# Altium schematic sheet StEth32_W5500.SchDoc
size A4
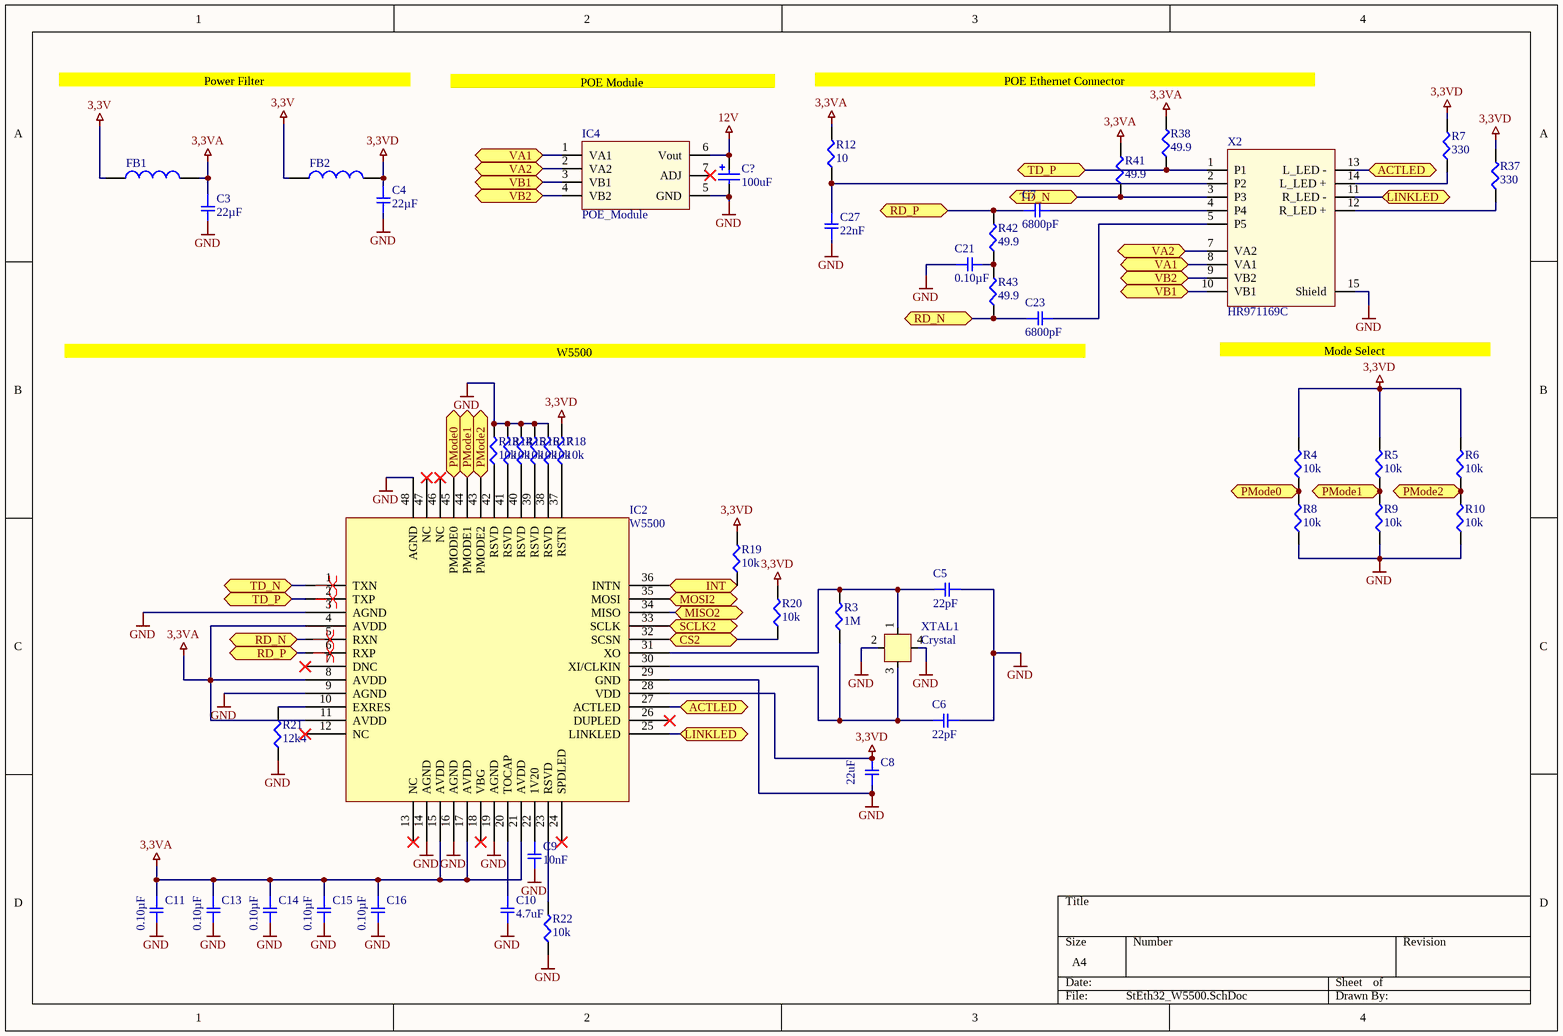
[diagram p0: StEth32_W5500.SchDoc]

## Parts
C3  22µF  [SMD-0603C]
C4  22µF  [SMD-0603C]
C5  22pF  [SMD-0603C]
C6  22pF  [SMD-0603C]
C7  6800pF  [SMD-0603C]
C8  22uF  [SMD-0603C]
C9  10nF  [SMD-0603C]
C10  4.7uF  [SMD-0603C]
C11  0.10µF  [SMD-0603C]
C13  0.10µF  [SMD-0603C]
C14  0.10µF  [SMD-0603C]
C15  0.10µF  [SMD-0603C]
C16  0.10µF  [SMD-0603C]
C21  0.10µF  [SMD-0603C]
C23  6800pF  [SMD-0603C]
C27  22nF  [SMD-0603C]
C?  value 100uF  [WCAP-ASLI_6.3x7.7]  (hidden comment: 865080445010)
FB1  600Ohm, 0.2A  [WE-CBF_0805_High Speed]  (value not drawn)
FB2  600Ohm, 0.2A  [WE-CBF_0805_High Speed]  (value not drawn)
IC2  W5500  [LQFP-48]
IC4  POE_Module  [POE_Module]
R3  1M  [SMD-0402-RES]
R4  10k  [SMD-0603-RES]
R5  10k  [SMD-0603-RES]
R6  10k  [SMD-0603-RES]
R7  330  [SMD-0603-RES]
R8  10k  [SMD-0603-RES]
R9  10k  [SMD-0603-RES]
R10  10k  [SMD-0603-RES]
R12  10  [SMD-0603-RES]
R13  10k  [SMD-0603-RES]
R14  10k  [SMD-0603-RES]
R15  10k  [SMD-0603-RES]
R16  10k  [SMD-0603-RES]
R17  10k  [SMD-0603-RES]
R18  10k  [SMD-0603-RES]
R19  10k  [SMD-0603-RES]
R20  10k  [SMD-0603-RES]
R21  12k4  [SMD-0603-RES]
R22  10k  [SMD-0603-RES]
R37  330  [SMD-0603-RES]
R38  49.9  [SMD-0603-RES]
R41  49.9  [SMD-0603-RES]
R42  49.9  [SMD-0603-RES]
R43  49.9  [SMD-0603-RES]
X2  HR971169C  [HR971169C]
XTAL1  Crystal  [3225]

## Ports
ACTLED (bidir), CS2 (bidir), INT (bidir), LINKLED (bidir), MISO2 (bidir), MOSI2 (bidir), PMode0 (bidir), PMode1 (bidir), PMode2 (bidir), RD_N (bidir), RD_P (bidir), SCLK2 (bidir), TD_N (bidir), TD_P (bidir), VA1 (bidir), VA2 (bidir), VB1 (bidir), VB2 (bidir)

## Nets
3,3V: FB1.1 FB2.1
3,3VA: C3.1 C11.1 C13.1 C14.1 C15.1 C16.1 FB1.2 IC2.4(AVDD) IC2.8(AVDD) IC2.11(AVDD) IC2.15(AVDD) IC2.17(AVDD) IC2.21(AVDD) R12.2 R38.2 R41.2
3,3VD: C4.1 C8.1 FB2.2 IC2.28(VDD) R4.2 R5.2 R6.2 R7.2 R18.2 R19.2 R20.2 R37.2
12V: C?.1(P) IC4.6(Vout)
GND: C3.2 C4.2 C5.1 C6.1 C8.2 C9.2 C10.2 C11.2 C13.2 C14.2 C15.2 C16.2 C21.1 C27.1 C?.2(N) IC2.3(AGND) IC2.9(AGND) IC2.14(AGND) IC2.16(AGND) IC2.19(AGND) IC2.29(GND) IC2.48(AGND) IC4.5(GND) R8.1 R9.1 R10.1 R13.2 R14.2 R15.2 R16.2 R17.2 R21.1 R22.1 X2.15(Shield) XTAL1.2 XTAL1.4
ACTLED: IC2.27(ACTLED) X2.13(L_LED_-) ; port ACTLED
CS2: IC2.32(SCSN) R20.1 ; port CS2
INT: IC2.36(INTN) R19.1 ; port INT
LINKLED: IC2.25(LINKLED) X2.11(R_LED_-) ; port LINKLED
MISO2: IC2.34(MISO) ; port MISO2
MOSI2: IC2.35(MOSI) ; port MOSI2
PMode0: IC2.45(PMODE0) R4.1 R8.2 ; port PMode0
PMode1: IC2.44(PMODE1) R5.1 R9.2 ; port PMode1
PMode2: IC2.43(PMODE2) R6.1 R10.2 ; port PMode2
RD_N: C23.1 IC2.5(RXN) R43.1 ; port RD_N
RD_P: C7.1 IC2.6(RXP) R42.2 ; port RD_P
SCLK2: IC2.33(SCLK) ; port SCLK2
TD_N: IC2.1(TXN) R41.1 X2.3(P3) ; port TD_N
TD_P: IC2.2(TXP) R38.1 X2.1(P1) ; port TD_P
VA1: IC4.1(VA1) X2.8(VA1) ; port VA1
VA2: IC4.2(VA2) X2.7(VA2) ; port VA2
VB1: IC4.3(VB1) X2.10(VB1) ; port VB1
VB2: IC4.4(VB2) X2.9(VB2) ; port VB2
NetC5_2: C5.2 IC2.31(XO) R3.2 XTAL1.1
NetC6_2: C6.2 IC2.30(XI/CLKIN) R3.1 XTAL1.3
NetC7_2: C7.2 X2.4(P4)
NetC9_1: C9.1 IC2.22(1V20)
NetC10_1: C10.1 IC2.20(TOCAP)
NetC21_2: C21.2 R42.1 R43.2
NetC23_2: C23.2 X2.5(P5)
NetC27_2: C27.2 R12.1 X2.2(P2)
NetIC2_10: IC2.10(EXRES) R21.2
NetIC2_23: IC2.23(RSVD) R22.2
NetIC2_37: IC2.37(RSTN) R18.1
NetIC2_38: IC2.38(RSVD) R17.1
NetIC2_39: IC2.39(RSVD) R16.1
NetIC2_40: IC2.40(RSVD) R15.1
NetIC2_41: IC2.41(RSVD) R14.1
NetIC2_42: IC2.42(RSVD) R13.1
NetR7_1: R7.1 X2.14(L_LED_+)
NetR37_1: R37.1 X2.12(R_LED_+)

Not connected (* = marked no-connect by the designer): IC2 7(DNC)* 12(NC)* 13(NC)* 18(VBG)* 24(SPDLED)* 26(DUPLED)* 46(NC)* 47(NC)*; IC4 7(ADJ)*

## Layout directives
differential pair: (no net found under the mark)

## Notes on the sheet
- Power Filter
- POE Module
- POE Ethernet Connector
- W5500
- (near X2) Mode Select

## Library data of the parts
C3 C4 = ZRB186R60G226ME11L: CAP CER 22UF 4V X5R 0603; Manufacturer: Murata Electronics North America; Factory Stock: 0; Unit Price (USD): 0.36; Minimum Quantity: 1; Tolerance: ±20%; Datasheets: http://psearch.en.murata.com/capacitor/product/ZRB186R60G226ME11%23.pdf; Image: //media.digikey.com/Renders/Murata%20Renders/0603%20(1608%20Metric).jpg; Digi-Key Part Number: 490-13253-1-ND; Part Number: ZRB186R60G226ME11L; Quantity Available: 3925; @ qty: 0; Packaging: Cut Tape (CT); Series: ZRB; Part Status: Active; Value: 22µF; Voltage: 4V; Temperature Coefficient: X5R; Operating Temperature: -55°C ~ 85°C; Features: Interposer Termination; Ratings: -; Applications: Acoustic Noise Reduction; Mounting Type: Surface Mount, MLCC; Package / Case: 0603 (1608 Metric); Size / Dimension: 0.063" L x 0.031" W (1.60mm x 0.80mm); Height - Seated (Max): -; Thickness (Max): 0.031" (0.80mm); Lead Spacing: -; Lead Style: -
C5 C6 C27 = GCM188R72A223KA37D: CAP CER 0.022UF 100V X7R 0603; Manufacturer: Murata Electronics North America; Factory Stock: 0; Unit Price (USD): 0.11; Minimum Quantity: 1; Tolerance: ±10%; Datasheets: http://www.murata.com/~/media/webrenewal/support/library/catalog/products/capacitor/mlcc/c03e.ashx; Image: //media.digikey.com/Renders/Murata%20Renders/0603%28GCM188%29.jpg; Digi-Key Part Number: 490-4782-1-ND; Part Number: GCM188R72A223KA37D; Quantity Available: 102005; @ qty: 0; Packaging: Cut Tape (CT); Series: GCM; Part Status: Active; Voltage: 100V; Temperature Coefficient: X7R; Operating Temperature: -55°C ~ 125°C; Features: -; Ratings: AEC-Q200; Applications: Automotive; Mounting Type: Surface Mount, MLCC; Package / Case: 0603 (1608 Metric); Size / Dimension: 0.063" L x 0.031" W (1.60mm x 0.80mm); Height - Seated (Max): -; Thickness (Max): 0.035" (0.90mm); Lead Spacing: -; Lead Style: -
  C5 C6: Value: 22pF
  C27: Value: 22nF
C7 C23 = GCM188R71H682KA37D: CAP CER 6800PF 50V X7R 0603; Manufacturer: Murata Electronics North America; Factory Stock: 0; Unit Price (USD): 0.1; Minimum Quantity: 1; Tolerance: ±10%; Datasheets: http://www.murata.com/~/media/webrenewal/support/library/catalog/products/capacitor/mlcc/c03e.ashx; Image: //media.digikey.com/Renders/Murata%20Renders/0603%28GCM188%29.jpg; Digi-Key Part Number: 490-6055-1-ND; Part Number: GCM188R71H682KA37D; Quantity Available: 31753; @ qty: 0; Packaging: Cut Tape (CT); Series: GCM; Part Status: Active; Value: 6800pF; Voltage: 50V; Temperature Coefficient: X7R; Operating Temperature: -55°C ~ 125°C; Features: -; Ratings: AEC-Q200; Applications: Automotive; Mounting Type: Surface Mount, MLCC; Package / Case: 0603 (1608 Metric); Size / Dimension: 0.063" L x 0.031" W (1.60mm x 0.80mm); Height - Seated (Max): -; Thickness (Max): 0.035" (0.90mm); Lead Spacing: -; Lead Style: -
C8 = GCM188R71C104KA37J: CAP CER 0.1UF 16V X7R 0603; Manufacturer: Murata Electronics North America; Factory Stock: 0; Unit Price (USD): 0.18; Minimum Quantity: 1; Tolerance: ±10%; Voltage: 6.3V; Datasheets: http://www.murata.com/~/media/webrenewal/support/library/catalog/products/capacitor/mlcc/c03e.ashx; Image: //media.digikey.com/Renders/Murata%20Renders/0603%28GCM188%29.jpg; Digi-Key Part Number: 490-8015-1-ND; Part Number: GCM188R71C104KA37J; Quantity Available: 17844; @ qty: 0; Packaging: Cut Tape (CT); Series: GCM; Part Status: Active; Value: 22uF; Temperature Coefficient: X7R; Operating Temperature: -55°C ~ 125°C; Features: -; Ratings: AEC-Q200; Applications: Automotive; Mounting Type: Surface Mount, MLCC; Package / Case: 0603 (1608 Metric); Size / Dimension: 0.063" L x 0.031" W (1.60mm x 0.80mm); Height - Seated (Max): -; Thickness (Max): 0.035" (0.90mm); Lead Spacing: -; Lead Style: -
C9 C21 = GCJ188R71C104KA01D: CAP CER 0.1UF 16V X7R 0603; Manufacturer: Murata Electronics North America; Factory Stock: 0; Unit Price (USD): 0.21; Minimum Quantity: 1; Tolerance: ±10%; Datasheets: http://www.murata.com/~/media/webrenewal/support/library/catalog/products/capacitor/mlcc/c03e.ashx; Image: //media.digikey.com/Renders/Murata%20Renders/0603%28LQG18%29.jpg; Digi-Key Part Number: 490-5796-1-ND; Part Number: GCJ188R71C104KA01D; Quantity Available: 22473; @ qty: 0; Packaging: Cut Tape (CT); Series: GCJ; Part Status: Active; Voltage: 16V; Temperature Coefficient: X7R; Operating Temperature: -55°C ~ 125°C; Features: Soft Termination; Ratings: AEC-Q200; Applications: Automotive, Boardflex Sensitive; Mounting Type: Surface Mount, MLCC; Package / Case: 0603 (1608 Metric); Size / Dimension: 0.063" L x 0.031" W (1.60mm x 0.80mm); Height - Seated (Max): -; Thickness (Max): 0.035" (0.90mm); Lead Spacing: -; Lead Style: -
  C9: Value: 10nF
  C21: Value: 0.10µF
C10 = GCJ188R71C104KA01D: CAP CER 0.1UF 16V X7R 0603; Manufacturer: Murata Electronics North America; Factory Stock: 0; Unit Price (USD): 0.21; Minimum Quantity: 1; Tolerance: ±10%; Voltage: 6.3V; Datasheets: http://www.murata.com/~/media/webrenewal/support/library/catalog/products/capacitor/mlcc/c03e.ashx; Image: //media.digikey.com/Renders/Murata%20Renders/0603%28LQG18%29.jpg; Digi-Key Part Number: 490-5796-1-ND; Part Number: GCJ188R71C104KA01D; Quantity Available: 22473; @ qty: 0; Packaging: Cut Tape (CT); Series: GCJ; Part Status: Active; Value: 4.7uF; Temperature Coefficient: X7R; Operating Temperature: -55°C ~ 125°C; Features: Soft Termination; Ratings: AEC-Q200; Applications: Automotive, Boardflex Sensitive; Mounting Type: Surface Mount, MLCC; Package / Case: 0603 (1608 Metric); Size / Dimension: 0.063" L x 0.031" W (1.60mm x 0.80mm); Height - Seated (Max): -; Thickness (Max): 0.035" (0.90mm); Lead Spacing: -; Lead Style: -
C11 C13-C16 = GCM188R71C104KA37J: CAP CER 0.1UF 16V X7R 0603; Manufacturer: Murata Electronics North America; Factory Stock: 0; Unit Price (USD): 0.18; Minimum Quantity: 1; Tolerance: ±10%; Datasheets: http://www.murata.com/~/media/webrenewal/support/library/catalog/products/capacitor/mlcc/c03e.ashx; Image: //media.digikey.com/Renders/Murata%20Renders/0603%28GCM188%29.jpg; Digi-Key Part Number: 490-8015-1-ND; Part Number: GCM188R71C104KA37J; Quantity Available: 17844; @ qty: 0; Packaging: Cut Tape (CT); Series: GCM; Part Status: Active; Value: 0.10µF; Voltage: 16V; Temperature Coefficient: X7R; Operating Temperature: -55°C ~ 125°C; Features: -; Ratings: AEC-Q200; Applications: Automotive; Mounting Type: Surface Mount, MLCC; Package / Case: 0603 (1608 Metric); Size / Dimension: 0.063" L x 0.031" W (1.60mm x 0.80mm); Height - Seated (Max): -; Thickness (Max): 0.035" (0.90mm); Lead Spacing: -; Lead Style: -
C? = 865080445010: WCAP-ASLI Aluminum Electrolytic Capacitors, size Ф6.3x7.7mm, 25V DC, 100uF; Rated Voltage: 25V DC; ComponentLink1Description: Manufacturer; ComponentLink1URL: http://www.we-online.de; ComponentLink2Description: Datasheet; ComponentLink2URL: http://katalog.we-online.de/pbs/datasheet/865080445010.pdf; Part Number: 865080445010; Published Date: June 2017; Publisher: Wurth Elektronik; Size: Ф6.3x7.7mm; Life Cycle: 2000h; Operating Temperature: -55 °C up to +105 °C
FB1 FB2 = 742792042: WE-CBF SMT EMI Suppression Ferrite Bead, size 0805, 600Ohm, 0.2A; Impedance max.: 3000Ohm; DC Resistance max.: 0.5Ohm; Type: High Speed; ComponentLink1Description: Manufacturer; ComponentLink1URL: http://www.we-online.de; ComponentLink2Description: Datasheet; ComponentLink2URL: https://katalog.we-online.com/pbs/datasheet/742792042.pdf; Part Number: 742792042; Published Date: March 2019; Publisher: Wurth Elektronik; Rated Current: 0.2A; Operating Temperature: -55 to +125degC; Impedance@100 MHz: 600Ohm; Mounting Technology: SMT; Packaging: Tape and Reel; Size: 0805
R3 = ERJ-2GEJ105X: RES SMD 1M OHM 5% 1/10W 0402; Manufacturer: Panasonic Electronic Components; Factory Stock: 0; Unit Price (USD): 0.00350; @ qty: 1500; Minimum Quantity: 1; Power (Watts): 0.1W, 1/10W; Temperature Coefficient: ±200ppm/°C; Part Number: ERJ-2GEJ105X; Datasheets: http://industrial.panasonic.com/www-cgi/jvcr13pz.cgi?E+PZ+3+AOA0001+ERJ2GEJ105X+7+WW; Image: //media.digikey.com/Photos/Panasonic%20Photos/ERJ-PA2-Series.jpg; Digi-Key Part Number: P1.0MJCT-ND; Quantity Available: 1082572; Packaging: Cut Tape (CT); Series: ERJ; Part Status: Active; Value: 1M; Tolerance: ±5%; Composition: Thick Film; Features: Automotive AEC-Q200; Operating Temperature: -55°C ~ 155°C; Package / Case: 0402 (1005 Metric); Supplier Device Package: 0402; Size / Dimension: 0.039" L x 0.020" W (1.00mm x 0.50mm); Height - Seated (Max): 0.016" (0.40mm); Number of Terminations: 2; Failure Rate: -
R4-R6 R8-R10 R13-R20 R22 = ERJ-3EKF1002V: RES SMD 10K OHM 1% 1/10W 0603; Manufacturer: Panasonic Electronic Components; Factory Stock: 0; Unit Price (USD): 0.00379; @ qty: 1500; Minimum Quantity: 1; Power (Watts): 0.1W, 1/10W; Temperature Coefficient: ±100ppm/°C; Part Number: ERJ-3EKF1002V; Datasheets: http://industrial.panasonic.com/www-cgi/jvcr13pz.cgi?E+PZ+3+AOA0002+ERJ3EKF1002V+7+WW; Image: //media.digikey.com/Photos/Panasonic%20Photos/MFG_ERJ-P6W%20Series.jpg; Digi-Key Part Number: P10.0KHCT-ND; Quantity Available: 6703141; Packaging: Cut Tape (CT); Series: ERJ; Part Status: Active; Value: 10k; Tolerance: ±1%; Composition: Thick Film; Features: Automotive AEC-Q200; Operating Temperature: -55°C ~ 155°C; Package / Case: 0603 (1608 Metric); Supplier Device Package: 0603; Size / Dimension: 0.063" L x 0.031" W (1.60mm x 0.80mm); Height - Seated (Max): 0.022" (0.55mm); Number of Terminations: 2; Failure Rate: -
R7 R12 R37 = ERJ-3EKF3300V: RES SMD 330 OHM 1% 1/10W 0603; Manufacturer: Panasonic Electronic Components; Factory Stock: 0; Unit Price (USD): 0.00379; @ qty: 1500; Minimum Quantity: 1; Power (Watts): 0.1W, 1/10W; Temperature Coefficient: ±100ppm/°C; Part Number: ERJ-3EKF3300V; Datasheets: http://industrial.panasonic.com/www-cgi/jvcr13pz.cgi?E+PZ+3+AOA0002+ERJ3EKF3300V+7+WW; Image: //media.digikey.com/Photos/Panasonic%20Photos/MFG_ERJ-P6W%20Series.jpg; Digi-Key Part Number: P330HCT-ND; Quantity Available: 670984; Packaging: Cut Tape (CT); Series: ERJ; Part Status: Active; Tolerance: ±1%; Composition: Thick Film; Features: Automotive AEC-Q200; Operating Temperature: -55°C ~ 155°C; Package / Case: 0603 (1608 Metric); Supplier Device Package: 0603; Size / Dimension: 0.063" L x 0.031" W (1.60mm x 0.80mm); Height - Seated (Max): 0.022" (0.55mm); Number of Terminations: 2; Failure Rate: -
  R7 R37: Value: 330
  R12: Value: 10
R21 = ERJ-3BQF1R1V: RES SMD 12,4 KOHM 1% 1/4W 0603; Manufacturer: Panasonic Electronic Components; Factory Stock: 0; Unit Price (USD): 0.05386; @ qty: 1500; Minimum Quantity: 1; Power (Watts): 0.25W, 1/4W; Temperature Coefficient: ±200ppm/°C; Part Number: ERJ-3BQF1R1V; Datasheets: https://industrial.panasonic.com/cdbs/www-data/pdf/RDA0000/AOA0000C239.pdf; Image: //media.digikey.com/Photos/Panasonic%20Photos/MFG_ERJ-P6W%20Series.jpg; Digi-Key Part Number: P17372CT-ND; Quantity Available: 3896; Packaging: Cut Tape (CT); Series: ERJ; Part Status: Active; Value: 12k4; Tolerance: ±1%; Composition: Thick Film; Features: Automotive AEC-Q200, Current Sense; Operating Temperature: -55°C ~ 125°C; Package / Case: 0603 (1608 Metric); Supplier Device Package: 0603; Size / Dimension: 0.063" L x 0.031" W (1.60mm x 0.80mm); Height - Seated (Max): 0.022" (0.55mm); Number of Terminations: 2; Failure Rate: -
R38 R41-R43 = ERJ-3EKF49R9V: RES SMD 49.9 OHM 1% 1/10W 0603; Manufacturer: Panasonic Electronic Components; Factory Stock: 0; Unit Price (USD): 0.00379; @ qty: 1500; Minimum Quantity: 1; Power (Watts): 0.1W, 1/10W; Temperature Coefficient: ±100ppm/°C; Part Number: ERJ-3EKF49R9V; Datasheets: http://industrial.panasonic.com/www-cgi/jvcr13pz.cgi?E+PZ+3+AOA0002+ERJ3EKF49R9V+7+WW; Image: //media.digikey.com/Photos/Panasonic%20Photos/MFG_ERJ-P6W%20Series.jpg; Digi-Key Part Number: P49.9HCT-ND; Quantity Available: 566023; Packaging: Cut Tape (CT); Series: ERJ; Part Status: Active; Value: 49.9; Tolerance: ±1%; Composition: Thick Film; Features: Automotive AEC-Q200; Operating Temperature: -55°C ~ 155°C; Package / Case: 0603 (1608 Metric); Supplier Device Package: 0603; Size / Dimension: 0.063" L x 0.031" W (1.60mm x 0.80mm); Height - Seated (Max): 0.022" (0.55mm); Number of Terminations: 2; Failure Rate: -
XTAL1 = 3225